# EAGLE design 001_01 (EAGLE 7.1.0)
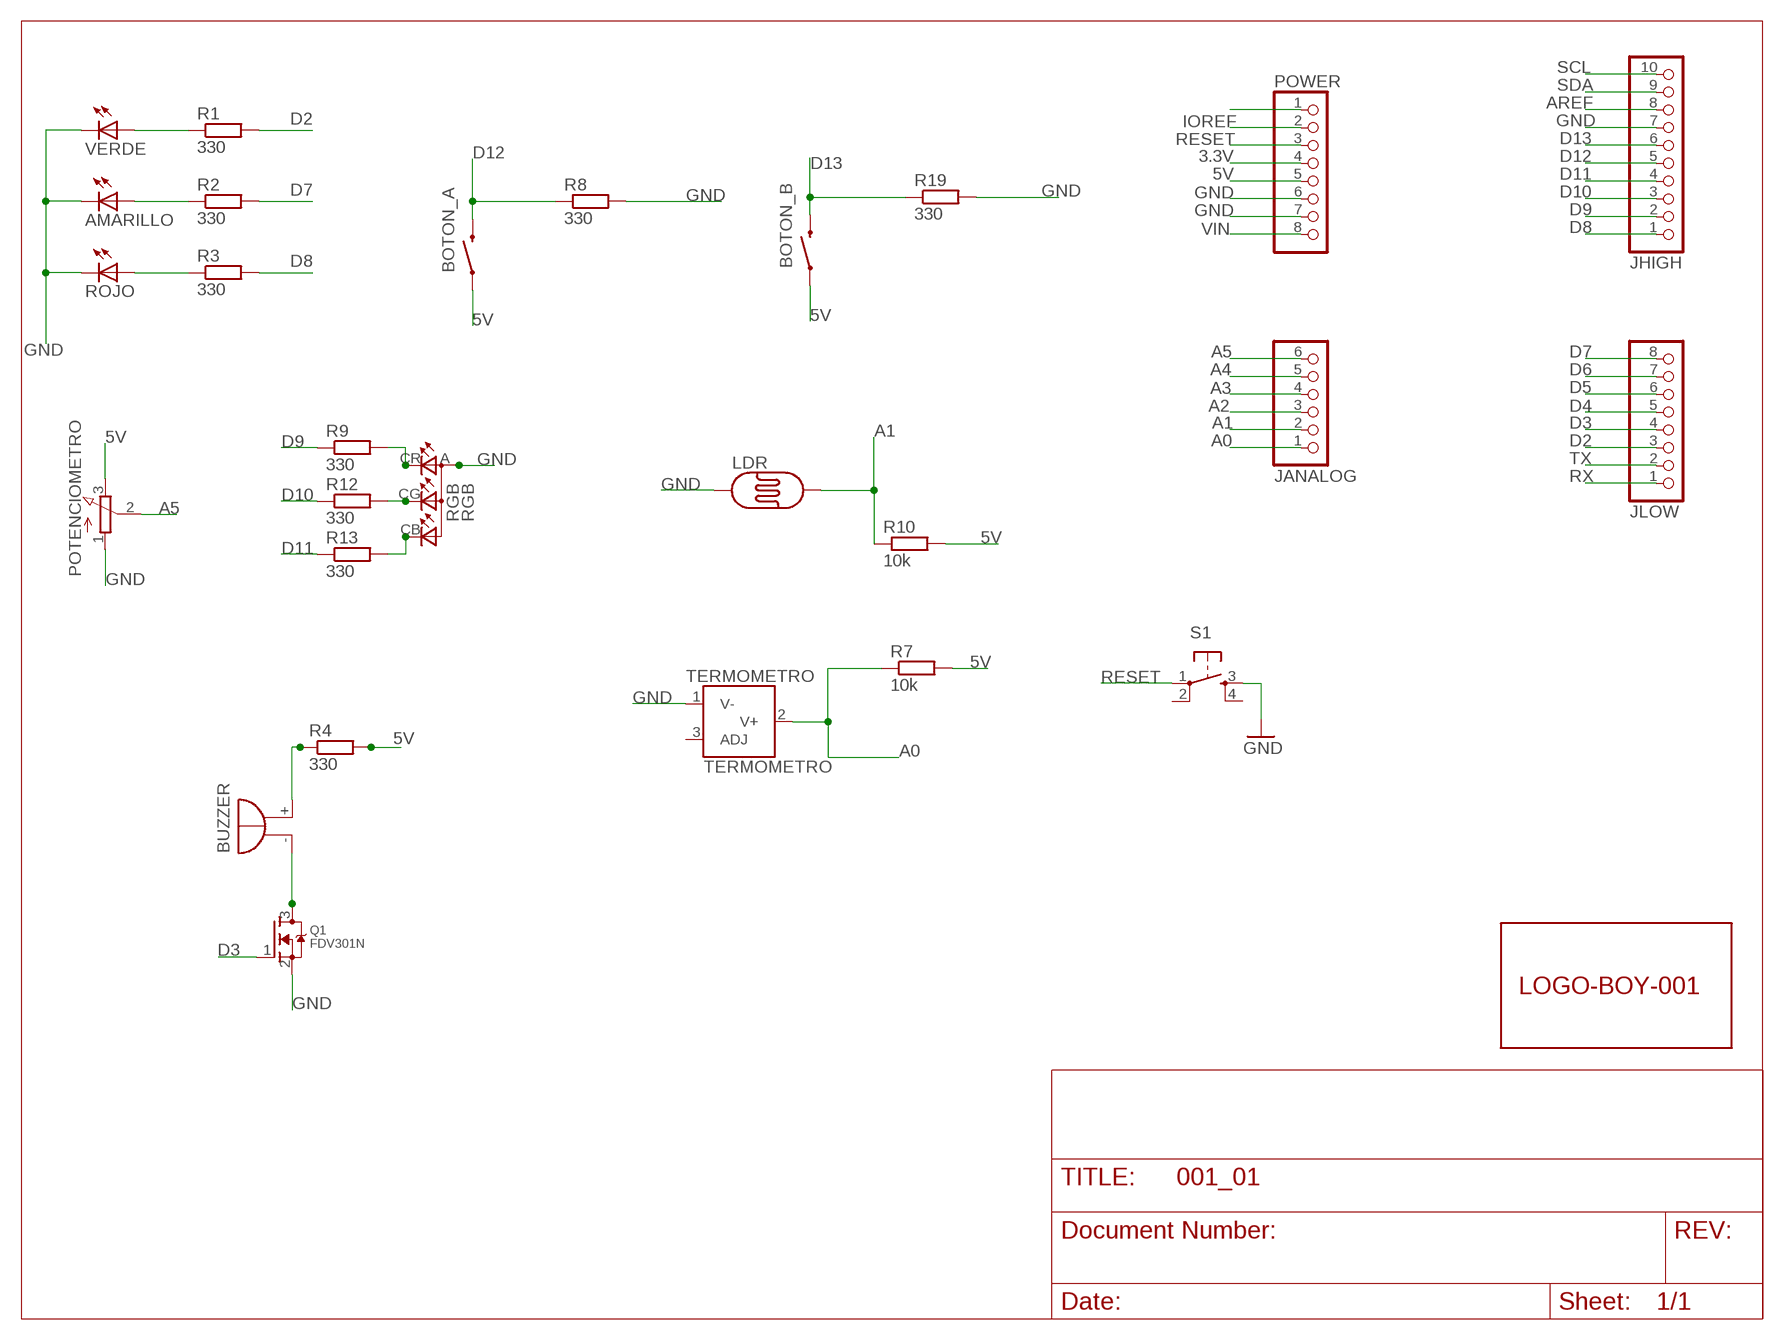
[diagram p0: schematic, sheet 1]

## Parts
AMARILLO  LED10MM  [LED10MM]
BOTON_A  SWITCH-MOMENTARY-212MM  [TACTILE-PTH-12MM]
BOTON_B  SWITCH-MOMENTARY-212MM  [TACTILE-PTH-12MM]
BUZZER  BUZZER  F/QMBIII  [F/QMBIII]
JANALOG  6x1F-H8.5-L14.5mm  PINHD-1X6TH  [1X06-TH]
JHIGH  10x1F-H8.5-L14.5mm  PINHD-1X10TH  [1X10-TH]
JLOW  8x1F-H8.5-L14.5mm  PINHD-1X8TH  [1X08-TH]
LDR  FOTOCELDA  PHOTOCELLPTH  [PHOTOCELL]
POTENCIOMETRO  POTENCIOMETRO  EVUF3A  [EVUF]
POWER  8x1F-H8.5-L14.5mm  PINHD-1X8TH  [1X08-TH]
Q1  FDV301N  MOSFET-NWAVE  [SOT23-W]
R1  330  R-EU_M1206  [M1206]
R2  330  R-EU_M1206  [M1206]
R3  330  R-EU_M1206  [M1206]
R4  330  R-EU_M1206  [M1206]
R7  10k  R-EU_M1206  [M1206]
R8  330  R-EU_M1206  [M1206]
R9  330  R-EU_M1206  [M1206]
R10  10k  R-EU_M1206  [M1206]
R12  330  R-EU_M1206  [M1206]
R13  330  R-EU_M1206  [M1206]
R19  330  R-EU_M1206  [M1206]
RGB  RGB  LED-RGB-10MM  [LED-RGB-10MM]
ROJO  LED10MM  [LED10MM]
S1  TAC_SWITCHSMD  [TACTILE_SWITCH_SMD]
TERMOMETRO  TERMOMETRO  LM335Z  [LM335Z]
U$1  LOGO-BOY-001  [LOGO-BOY-001]
VERDE  LED10MM  [LED10MM]

## Nets
3.3V: POWER.4
5V: BOTON_A.1 BOTON_B.1 POTENCIOMETRO.3(E) POWER.5 R4.2 R7.2 R10.2
A0: JANALOG.1 R7.1 TERMOMETRO.2(V+)
A1: JANALOG.2 LDR.2 R10.1
A2: JANALOG.3
A3: JANALOG.4
A4: JANALOG.5
A5: JANALOG.6 POTENCIOMETRO.2(S)
AREF: JHIGH.8
D2: JLOW.3 R1.2
D3: JLOW.4 Q1.1(G)
D4: JLOW.5
D5: JLOW.6
D6: JLOW.7
D7: JLOW.8 R2.2
D8: JHIGH.1 R3.2
D9: JHIGH.2 R9.1
D10: JHIGH.3 R12.1
D11: JHIGH.4 R13.1
D12: BOTON_A.3 JHIGH.5 R8.1
D13: BOTON_B.3 JHIGH.6 R19.1
GND: AMARILLO.K(C) JHIGH.7 LDR.1 POTENCIOMETRO.1(A) POWER.6 POWER.7 Q1.2(S) R8.2 R19.2 RGB.A ROJO.K(C) S1.3 TERMOMETRO.1(V-) VERDE.K(C)
IOREF: POWER.2
N$2: R9.2 RGB.CR
N$3: R12.2 RGB.CG
N$4: R13.2 RGB.CB
N$5: BUZZER.+(-) R4.1
N$7: R1.1 VERDE.A
N$8: AMARILLO.A R2.1
N$9: R3.1 ROJO.A
N$11: BUZZER.-(+) Q1.3(D)
N$14: POWER.1
RESET: POWER.3 S1.1
RX: JLOW.1
SCL: JHIGH.10
SDA: JHIGH.9
TX: JLOW.2
VIN: POWER.8
Unconnected: S1.2 S1.4 TERMOMETRO.3(ADJ)

## Library data of the parts
AMARILLO ROJO VERDE = led:LED: LED OSRAM: - CHIPLED LG R971, LG N971, LY N971, LG Q971, LY Q971, LO R971, LY R971 LH N974, LH R974 LS Q976, LO Q976, LY Q976 LO Q996 - Hyper CHIPLED LW Q18S LB Q993, LB Q99A, LB R99A - SideLED LS A670, LO A670, LY A670, LG A670, LP A670 LB A673, LV A673, LT A673, LW A673 LH A674 LY A675 LS A676, LA A676, LO A676, LY A676, LW A676 LS A679, LY A679, LG A679 - Hyper Micro SIDELED® LS Y876, LA Y876, LO Y876, LY Y876 LT Y87S - SmartLED LW L88C, LW L88S LB L89C, LB L89S, LG L890 LS L89K, LO L89K, LY L89K LS L896, LA L896, LO L896, LY L896 - TOPLED LS T670, LO T670, LY T670, LG T670, LP T670 LSG T670, LSP T670, LSY T670, LOP T670, LYG T670 LG T671, LOG T671, LSG T671 LB T673, LV T673, LT T673, LW T673 LH T674 LS T676, LA T676, LO T676, LY T676, LB T676, LH T676, LSB T676, LW T676 LB T67C, LV T67C, LT T67C, LS T67K, LO T67K, LY T67K, LW E67C LS E67B, LA E67B, LO E67B, LY E67B, LB E67C, LV E67C, LT E67C LW T67C LS T679, LY T679, LG T679 LS T770, LO T770, LY T770, LG T770, LP T770 LB T773, LV T773, LT T773, LW T773 LH T774 LS E675, LA E675, LY E675, LS T675 LS T776, LA T776, LO T776, LY T776, LB T776 LHGB T686 LT T68C, LB T68C - Hyper Mini TOPLED® LB M676 - Mini TOPLED Santana® LG M470 LS M47K, LO M47K, LY M47K Source: http://www.osram.convergy.de LUXEON: - LUMILED® LXK2-PW12-R00, LXK2-PW12-S00, LXK2-PW14-U00, LXK2-PW14-V00 LXK2-PM12-R00, LXK2-PM12-S00, LXK2-PM14-U00 LXK2-PE12-Q00, LXK2-PE12-R00, LXK2-PE12-S00, LXK2-PE14-T00, LXK2-PE14-U00 LXK2-PB12-K00, LXK2-PB12-L00, LXK2-PB12-M00, LXK2-PB14-N00, LXK2-PB14-P00, LXK2-PB14-Q00 LXK2-PR12-L00, LXK2-PR12-M00, LXK2-PR14-Q00, LXK2-PR14-R00 LXK2-PD12-Q00, LXK2-PD12-R00, LXK2-PD12-S00 LXK2-PH12-R00, LXK2-PH12-S00 LXK2-PL12-P00, LXK2-PL12-Q00, LXK2-PL12-R00 Source: www.luxeon.com KINGBRIGHT: KA-3528ASYC Source: www.kingbright.com
BOTON_A BOTON_B = SparkFun-Electromechanical:SWITCH-MOMENTARY-2: Various NO switches- pushbuttons, reed, etc; PROD_ID: SWCH-09185
BUZZER = buzzer:F/QMBIII: BUZZER Source: Buerklin; OC_FARNELL: unknown; OC_NEWARK: unknown
JANALOG = SmartPrj:PINHD-1X6: PIN HEADER
JHIGH = SmartPrj:PINHD-1X10: PIN HEADER
JLOW POWER = SmartPrj:PINHD-1X8: PIN HEADER
LDR = SparkFun-Sensors:PHOTOCELL: CdS photoresistor. This is a low cost way to detect light levels. Resistance decreases with more incoming light. SparkFun SKU: SEN-09088
POTENCIOMETRO = pot:EVU: 9 mm Square Rotary Potentiometers Source: Panasonic
Q1 = adafruit:MOSFET-N: N-Channel Mosfet 2N7002E - 60V 260mA SOT23 [Digikey: 2N7002ET1GOSTR-ND] - REEL BSH103 - 30V 850mA SOT23 [Digikey: 568-5013-1-ND]
R1-R4 R7-R10 R12 R13 R19 = rcl:R-EU_: RESISTOR, European symbol
RGB = mazduino:LED-RGB-10MM
S1 = SparkFun:TAC_SWITCH: Momentary Switch Button commonly used for reset or general input. Spark Fun Electronics SKU : COM-00097
TERMOMETRO = mazduino:LM335Z
U$1 = MazDuinoLogos:LOGO-BOY-001

## Net classes
1 power: width 0.406 mm, drill 0.61 mm, clearance 0.152 mm
2 VIN: width 0.406 mm, drill 0.61 mm, clearance 0.152 mm

## Board
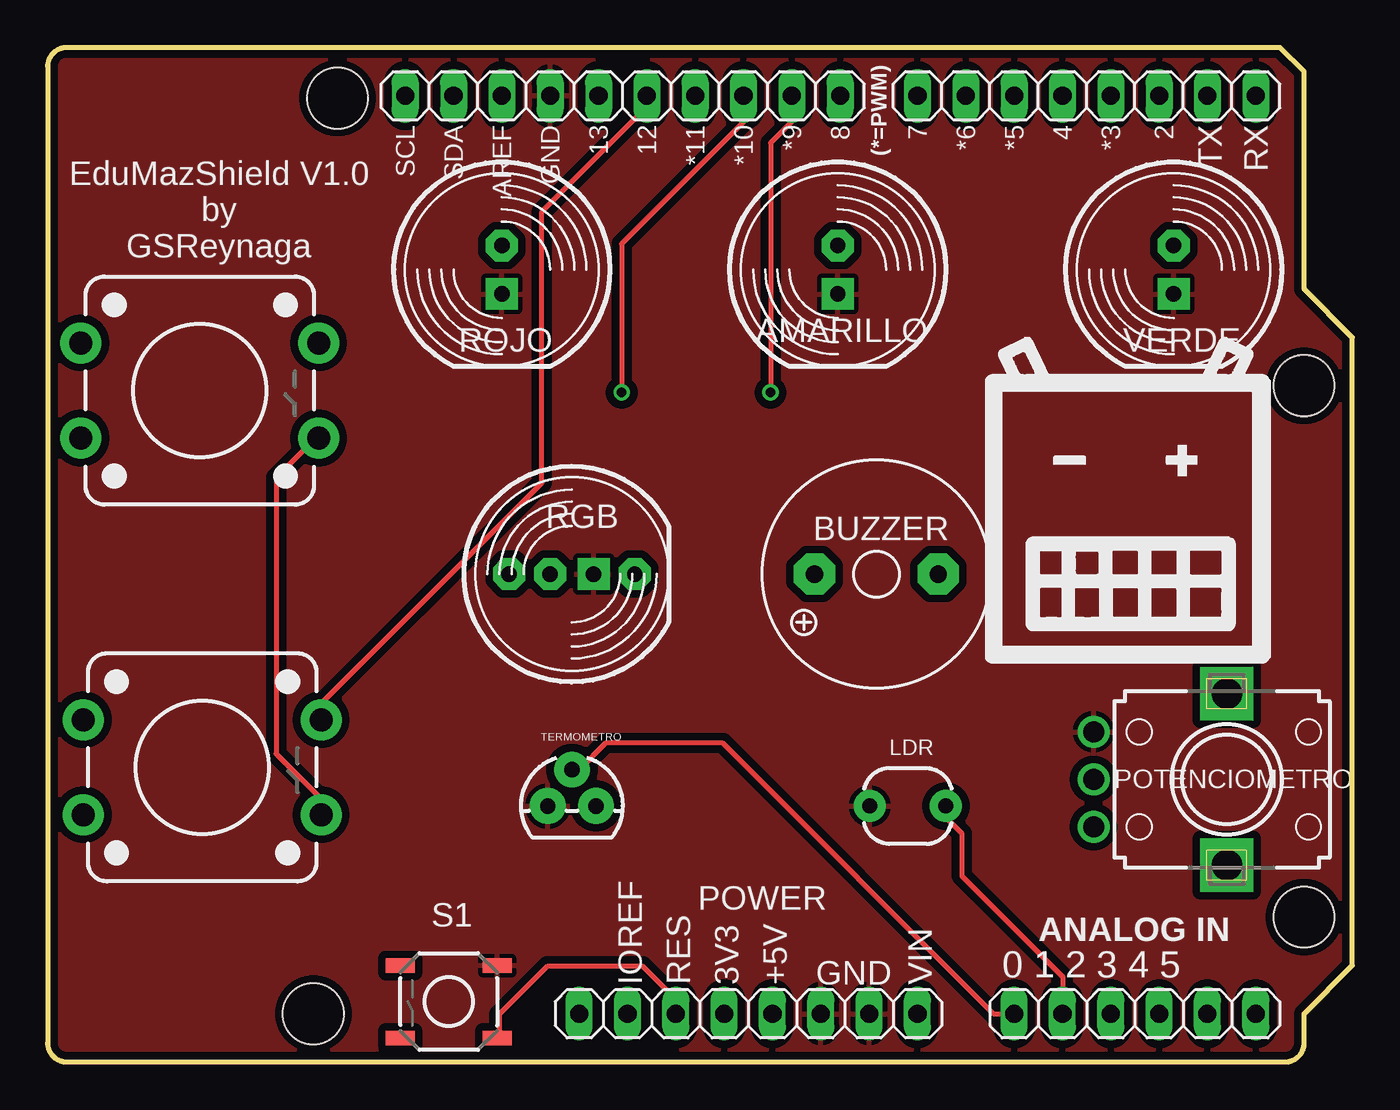
[diagram p1: board, top side]
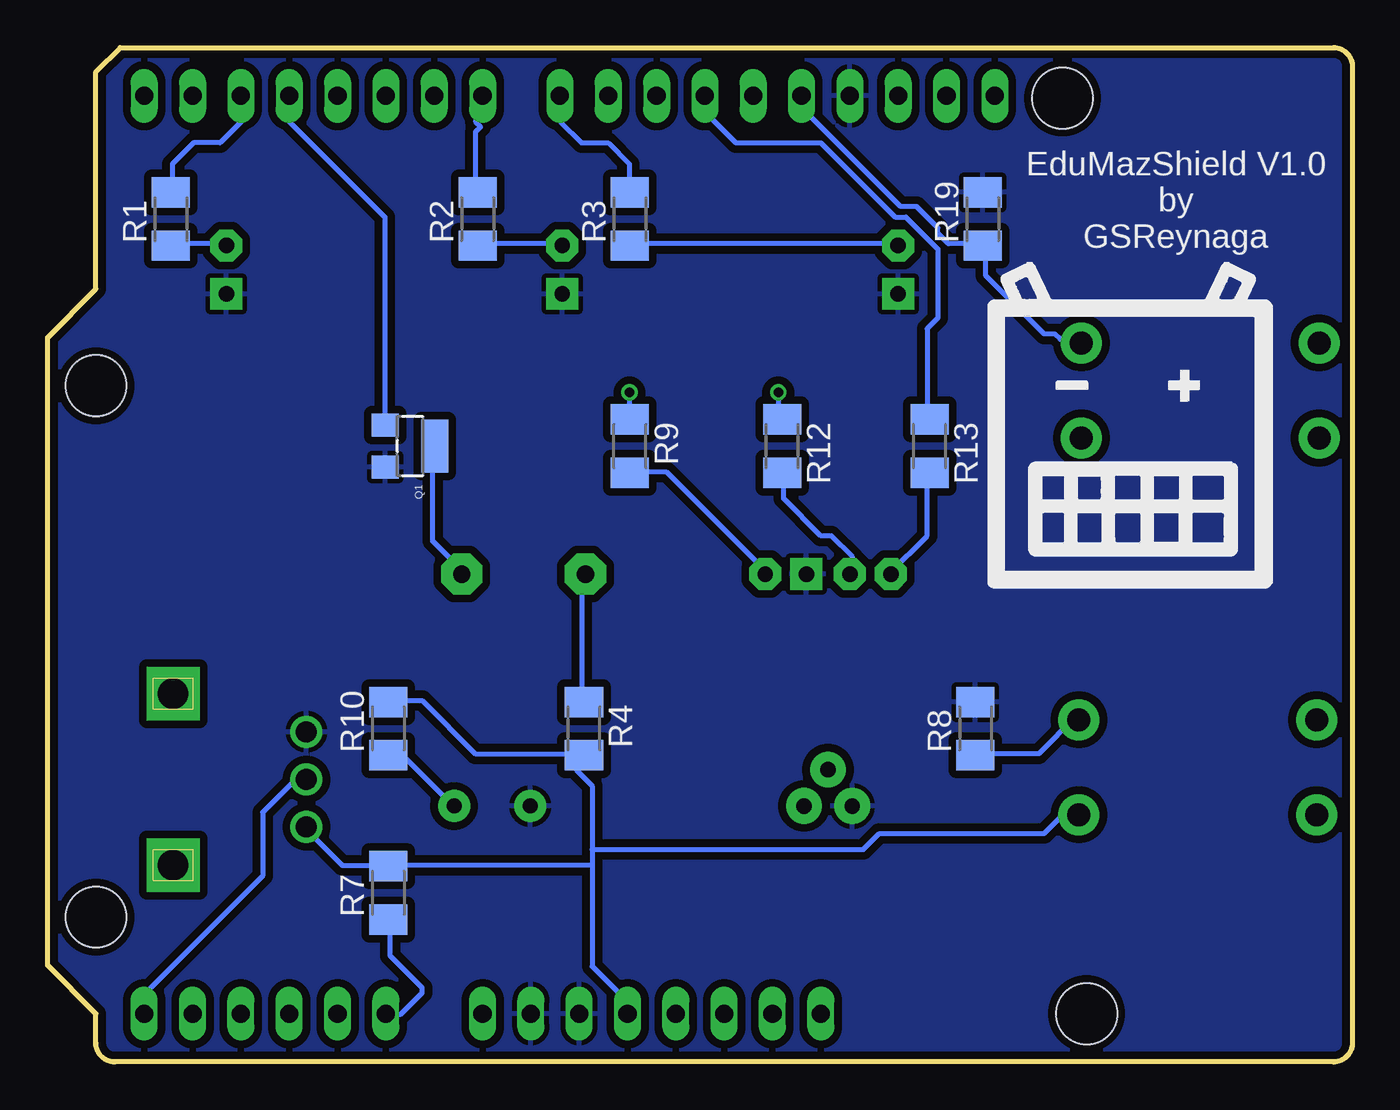
[diagram p2: board, bottom side, seen from below]

Size 68.58 x 53.34 mm. Coordinates in mm from the lower left corner, seen from the top.
Outline: 66.04,2.54 68.58,5.08 68.58,38.1 66.04,40.64 66.04,52.07 64.77,53.34 1,53.34 arc90 0,52.34 0,1 arc90 1,0 65.04,0 arc90 66.04,1 66.04,2.54
Copper layers (1*16): Top 0.0356mm / dielectric 1.5011mm / Bottom 0.0356mm
Design rules "LaenPCBOrder": minimum track width 6mil, minimum drill 13mil, track to track 6mil, track to pad 6mil, pad to pad 6mil, via to via 6mil, smd to smd 6mil, copper to edge 15mil, drill to drill 6mil, minimum pad ring 7mil, minimum via ring 7mil, stop-mask expansion 3mil, vias tented up to drill 0mil, thermal gap 10mil
Holes 3.2 mm at 66.04,35.56 66.04,7.62 15.24,50.67 13.97,2.54

### Footprints (pad centres in the part's own frame; a part is rotated, then mirrored left to right if it is on the bottom)
LED10MM = drill 0.813 pad 1.676 octagon: A -1.27,0 | drill 0.813 pad 1.676 square: K 1.27,0
TACTILE-PTH-12MM = drill 1.2 pad 2.159: 1 6.25,-2.5; 2 -6.25,-2.5; 3 6.25,2.5; 4 -6.25,2.5
F/QMBIII = drill 0.914 pad 2.159 octagon: + 3.251,0; - -3.251,0
1X06-TH = drill 0.95 pad 1.422 long: 1 -6.35,0; 2 -3.81,0; 3 -1.27,0; 4 1.27,0; 5 3.81,0; 6 6.35,0
1X10-TH = drill 0.95 pad 1.422 long: 1 -11.43,0; 2 -8.89,0; 3 -6.35,0; 4 -3.81,0; 5 -1.27,0; 6 1.27,0; 7 3.81,0; 8 6.35,0; 9 8.89,0; 10 11.43,0
1X08-TH = drill 0.95 pad 1.422 long: 1 -8.89,0; 2 -6.35,0; 3 -3.81,0; 4 -1.27,0; 5 1.27,0; 6 3.81,0; 7 6.35,0; 8 8.89,0
PHOTOCELL = drill 0.8 pad 1.676: 1 -2,0; 2 2,0
EVUF = drill 1.1 pad 1.676: 1 -2.5,-7; 2 0,-7; 3 2.5,-7 | drill 1.6 pad 2.8 square: M1 4.5,0; M2 -4.5,0
SOT23-W = smd 1.2 x 1.4: 1 -1.1,-1.3; 2 1.1,-1.3 | smd 2.8 x 1.4: 3 0,1.3
M1206 = smd 1.6 x 2: 1 -1.4,0; 2 1.4,0
LED-RGB-10MM = drill 0.813 pad 1.676 square: A 1.143,0 | drill 0.813 pad 1.676 octagon: CB -3.302,0; CG -1.143,0; CR 3.302,0
TACTILE_SWITCH_SMD = smd 1.524 x 0.762: 1 -2.54,1.905; 2 2.54,1.905; 3 -2.54,-1.905; 4 2.54,-1.905
LM335Z = drill 0.813 pad 1.88: 1 -1.27,0; 2 0,1.905; 3 1.27,0

### Placement (x,y rotation side)
AMARILLO  41.53,41.66 270 top
BOTON_A  8.13,15.49 0 top
BOTON_B  8,35.31 0 top
BUZZER  43.56,25.65 180 top
JANALOG  57.15,2.54 0 top
JHIGH  30.23,50.8 180 top
JLOW  54.61,50.8 180 top
LDR  45.21,13.46 0 top
POTENCIOMETRO  61.98,14.86 270 top
POWER  36.83,2.54 0 top
Q1  49.53,32.38 270 bottom
R1  62.1,44.32 90 bottom
R2  45.97,44.32 90 bottom
R3  37.97,44.32 90 bottom
R4  40.39,17.53 270 bottom
R7  50.67,8.89 90 bottom
R8  19.81,17.53 90 bottom
R9  37.97,32.38 270 bottom
R10  50.67,17.53 90 bottom
R12  29.97,32.38 270 bottom
R13  22.23,32.38 270 bottom
R19  19.43,44.32 90 bottom
RGB  27.56,25.65 0 top
ROJO  23.88,41.66 270 top
S1  21.08,3.17 180 top
TERMOMETRO  27.56,13.46 0 top
U$1  49.28,20.95 0 top
U$2  LOGO-BOY-001  [LOGO-BOY-001]  19.18,24.89 0 bottom
VERDE  59.18,41.66 270 top

### Tracks (layer width: path | path; a pad name or v marks a point on that pad's centre or on a via)
5V
  Top 0.254: BOTON_A.1 14.25,13.13 14.25,13.97 12.01,16.2 12.01,30.73 14.25,32.97 BOTON_B.1
  Bottom 0.254: POTENCIOMETRO.3 55.04,12.29 53.09,10.34 50.85,10.34 R7.2 50.57,10.34 39.95,10.34 | 40.79,16.2 46.1,16.2 48.9,19 50.57,19 R10.2 | 40.79,16.2 40.51,16.2 R4.2 40.79,16.2 | 39.95,11.18 39.95,14.53 40.79,15.37 40.79,16.2 | 39.95,11.18 39.95,10.34 | 39.95,10.34 39.95,5.03 38.28,3.35 38.28,2.79 POWER.5 | 39.95,11.18 25.7,11.18 24.87,12.01 16.2,12.01 15.37,12.85 14.53,12.85 BOTON_A.1
A0
  Top 0.254: TERMOMETRO.2 27.94,15.37 29.34,16.76 35.48,16.76 49.73,2.52 50.57,2.52 JANALOG.1
  Bottom 0.254: R7.1 50.57,7.26 50.57,5.59 48.9,3.91 48.9,3.63 50.01,2.52 50.57,2.52 JANALOG.1
A1
  Top 0.254: JANALOG.2 53.37,2.79 53.37,4.47 48.06,9.78 48.06,12.01 47.22,12.85 47.22,13.41 LDR.2
  Bottom 0.254: R10.1 50.57,15.93 49.73,15.93 47.22,13.41 LDR.2
A5
  Bottom 0.254: JANALOG.6 63.42,2.79 63.42,3.63 57.28,9.78 57.28,13.13 55.6,14.81 55.04,14.81 POTENCIOMETRO.2
D2
  Bottom 0.254: R1.2 62.03,45.82 62.03,47.22 60.91,48.34 59.51,48.34 58.4,49.45 58.4,50.57 JLOW.3
D3
  Bottom 0.254: Q1.1 50.85,33.53 50.85,44.42 56.16,49.73 56.16,50.29 55.88,50.57 JLOW.4
D7
  Bottom 0.254: R2.2 46.1,45.82 46.1,48.9 45.82,49.17 46.1,49.45 45.82,49.73 45.82,50.57 JLOW.8
D8
  Bottom 0.254: R3.2 38,45.82 38,47.22 39.12,48.34 40.51,48.34 41.63,49.45 41.63,50.57 JHIGH.1
D9  (via drill 0.5)
  Top 0.254: v38,35.2 38,48.34 39.4,49.73 39.4,50.29 39.12,50.57 JHIGH.2
  Bottom 0.254: v38,35.2 38,33.81 R9.1
D10  (via drill 0.5)
  Top 0.254: v30.18,35.2 30.18,43.03 36.6,49.45 36.6,50.57 JHIGH.3
  Bottom 0.254: v30.18,35.2 30.18,33.81 R12.1
D11
  Bottom 0.254: R13.1 22.35,33.81 22.35,38.56 21.79,39.12 21.79,42.75 23.47,44.42 24.03,44.42 27.94,48.34 32.41,48.34 33.81,49.73 33.81,50.57 JHIGH.4
D12
  Top 0.254: JHIGH.5 31.29,50.57 31.29,50.01 25.98,44.7 25.98,30.45 14.53,19 14.53,18.16 BOTON_A.3
  Bottom 0.254: R8.1 19.56,16.2 16.48,16.2 14.53,18.16 BOTON_A.3
D13
  Bottom 0.254: BOTON_B.3 14.53,38 15.37,38 15.65,38.28 16.2,38.28 19.28,41.35 19.28,42.75 R19.1 19.56,43.03 21.23,43.03 21.79,43.59 21.79,43.87 22.91,44.98 23.75,44.98 28.78,50.01 28.78,50.57 JHIGH.6
GND
  pour Bottom (isolate 0.406): -0.25,53.47 68.2,53.34 68.71,0.13 0,0
  pour Top (isolate 0.406): -0.13,53.47 68.2,53.34 68.71,0.13 0,0
N$2
  Bottom 0.254: R9.2 37.72,31.01 36.04,31.01 30.73,25.7 RGB.CR
N$3
  Bottom 0.254: R12.2 29.9,30.73 29.9,29.62 27.94,27.66 27.38,27.66 26.26,26.54 26.26,25.7 RGB.CG
N$4
  Bottom 0.254: R13.2 22.35,30.73 22.35,27.66 24.31,25.7 RGB.CB
N$5
  Bottom 0.254: R4.1 40.51,19 40.51,25.43 BUZZER.+
N$7
  Bottom 0.254: R1.1 62.03,43.03 59.23,43.03 VERDE.A
N$8
  Bottom 0.254: R2.1 45.82,43.03 41.63,43.03 AMARILLO.A
N$9
  Bottom 0.254: R3.1 37.72,43.03 24.03,43.03 ROJO.A
N$11
  Bottom 0.254: Q1.3 48.34,32.13 48.34,27.38 46.66,25.7 BUZZER.-
RESET
  Top 0.254: S1.1 23.75,1.4 23.75,2.52 26.26,5.03 31.29,5.03 32.97,3.35 32.97,2.79 POWER.3

### Text on the board
tNames: (*=PWM) | SCL | SDA | AREF | GND | 13 | 12 | *11 | *10 | *9 | 8 | 7 | *6 | *5 | 4 | *3 | 2 | TX | RX | EduMazShield V1.0 / by / GSReynaga | ANALOG IN | IOREF | RES | 3V3 | +5V | GND | VIN | 0 1 2 3 4 5
bNames: EduMazShield V1.0 / by / GSReynaga